# EAGLE schematic FUSE (EAGLE 9.2.2)
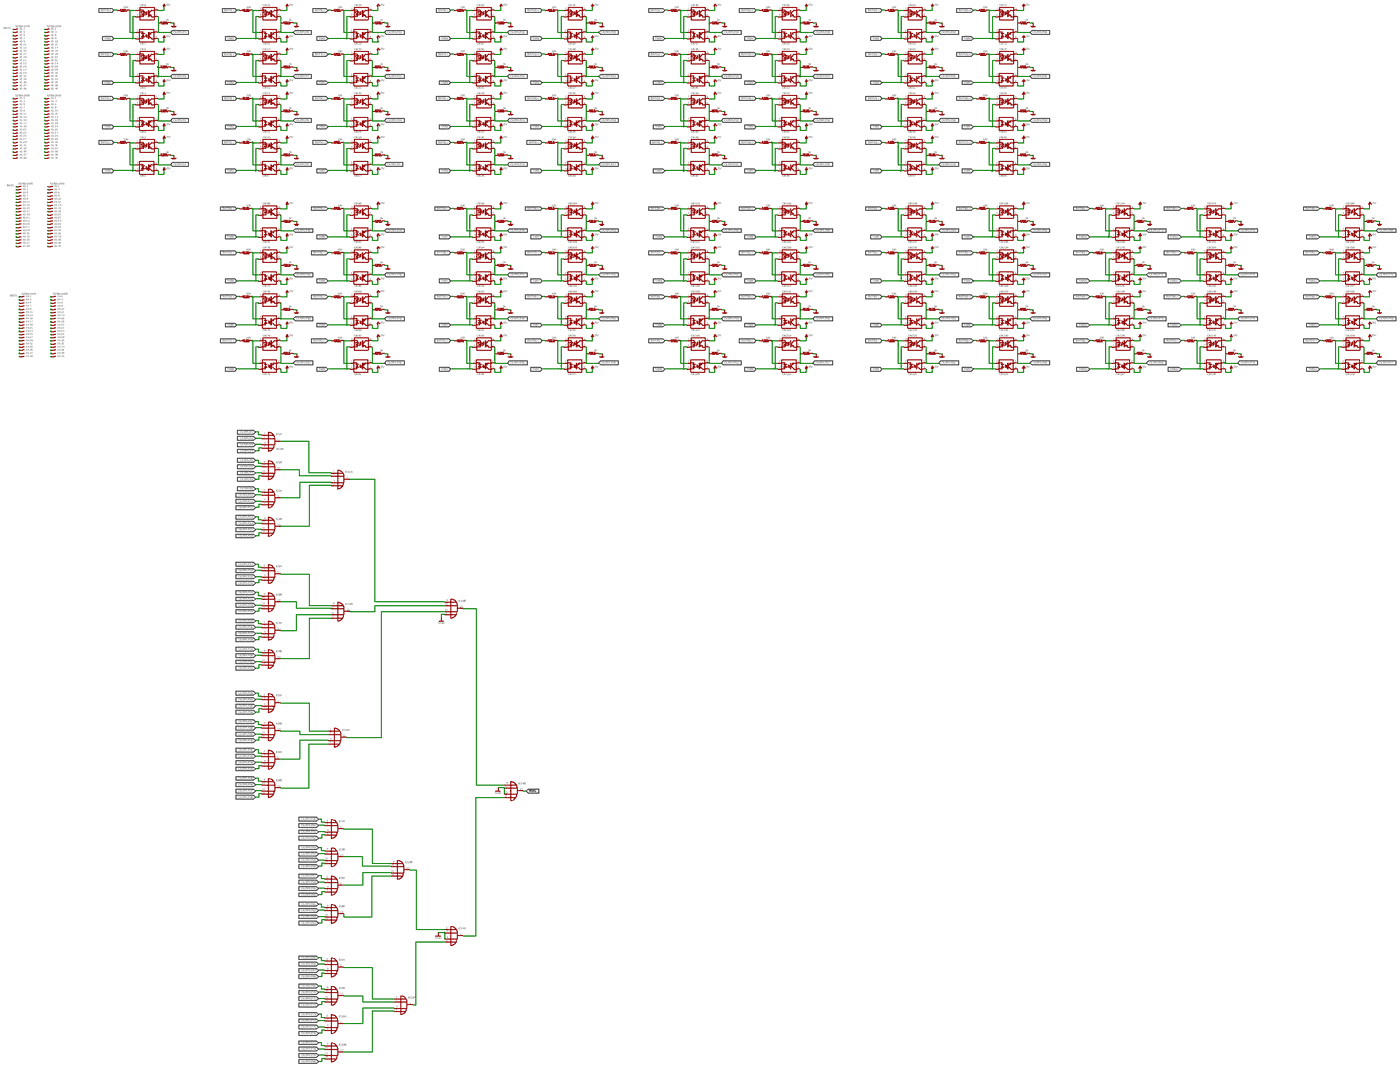
[diagram p0: schematic, sheet 1, overview]
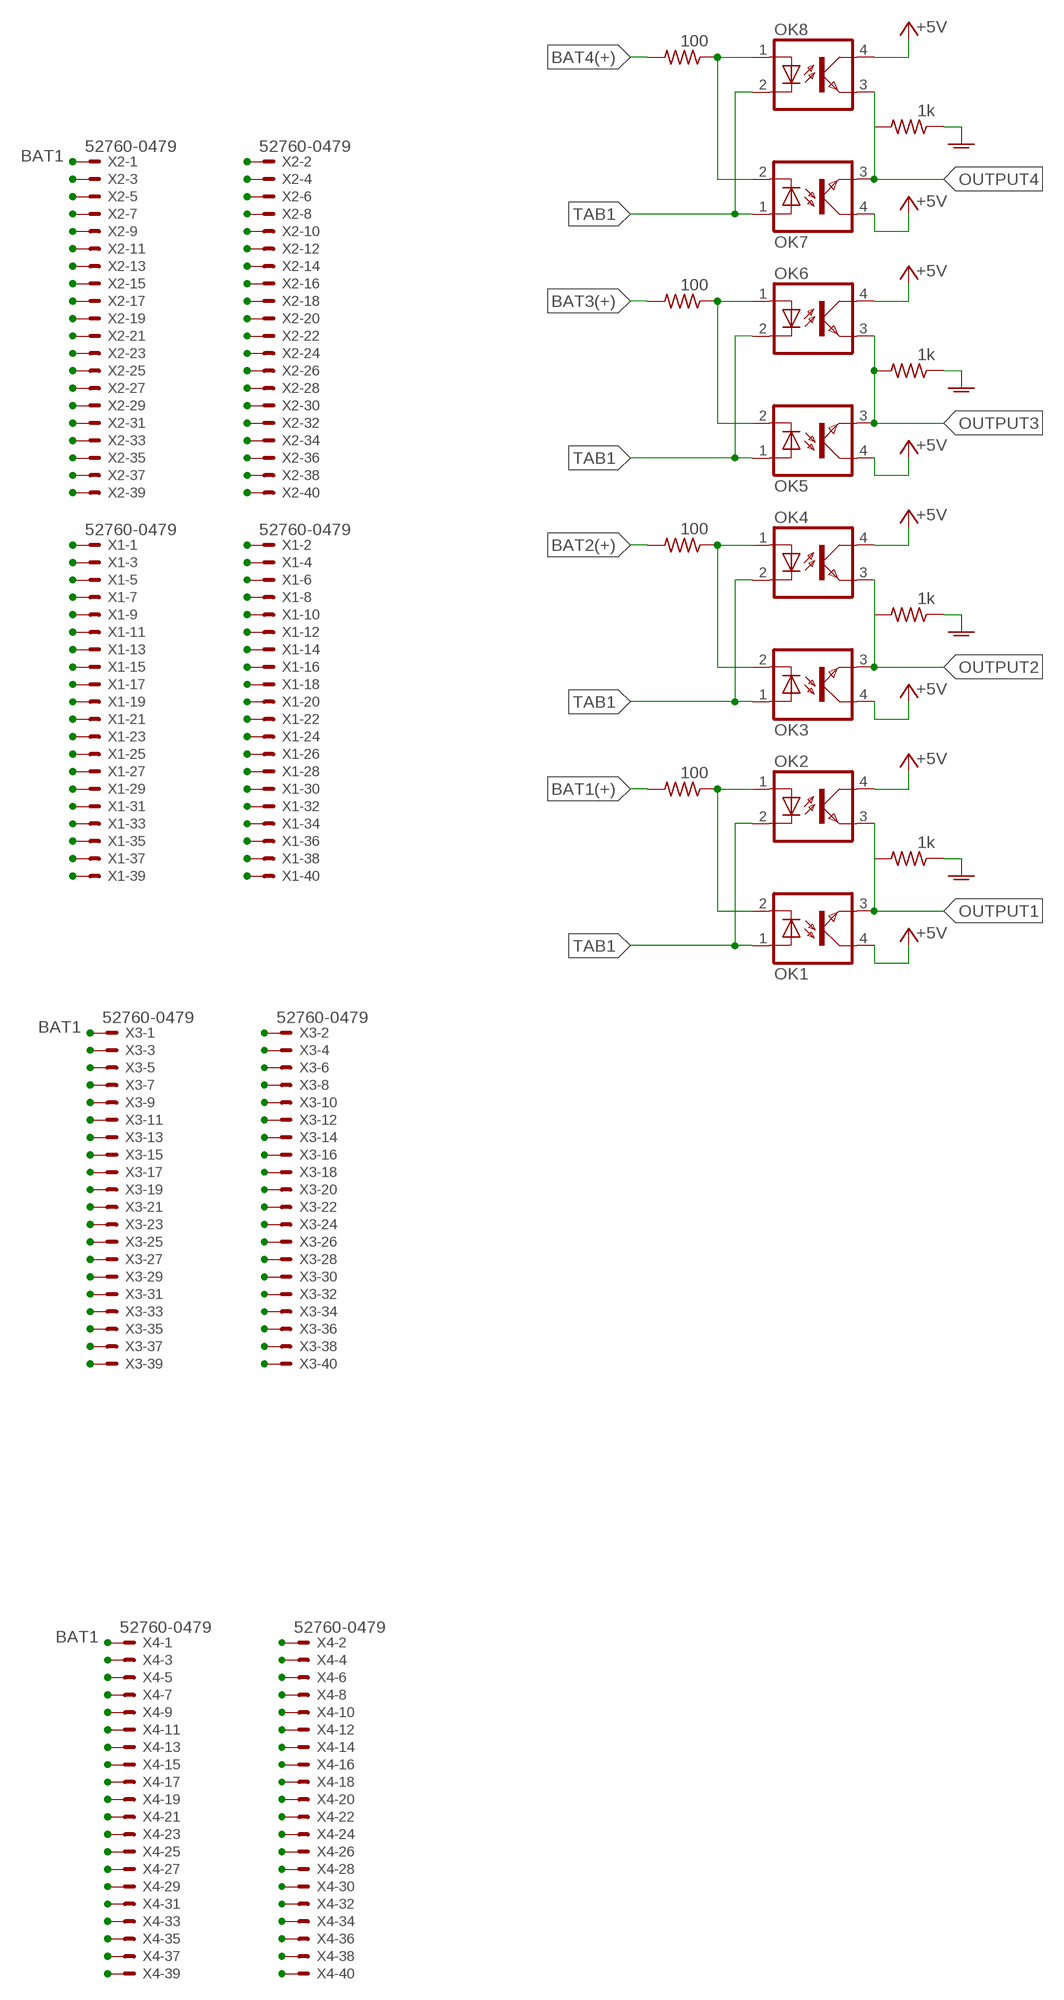
[diagram p1: schematic, sheet 1, part 1 of 5]
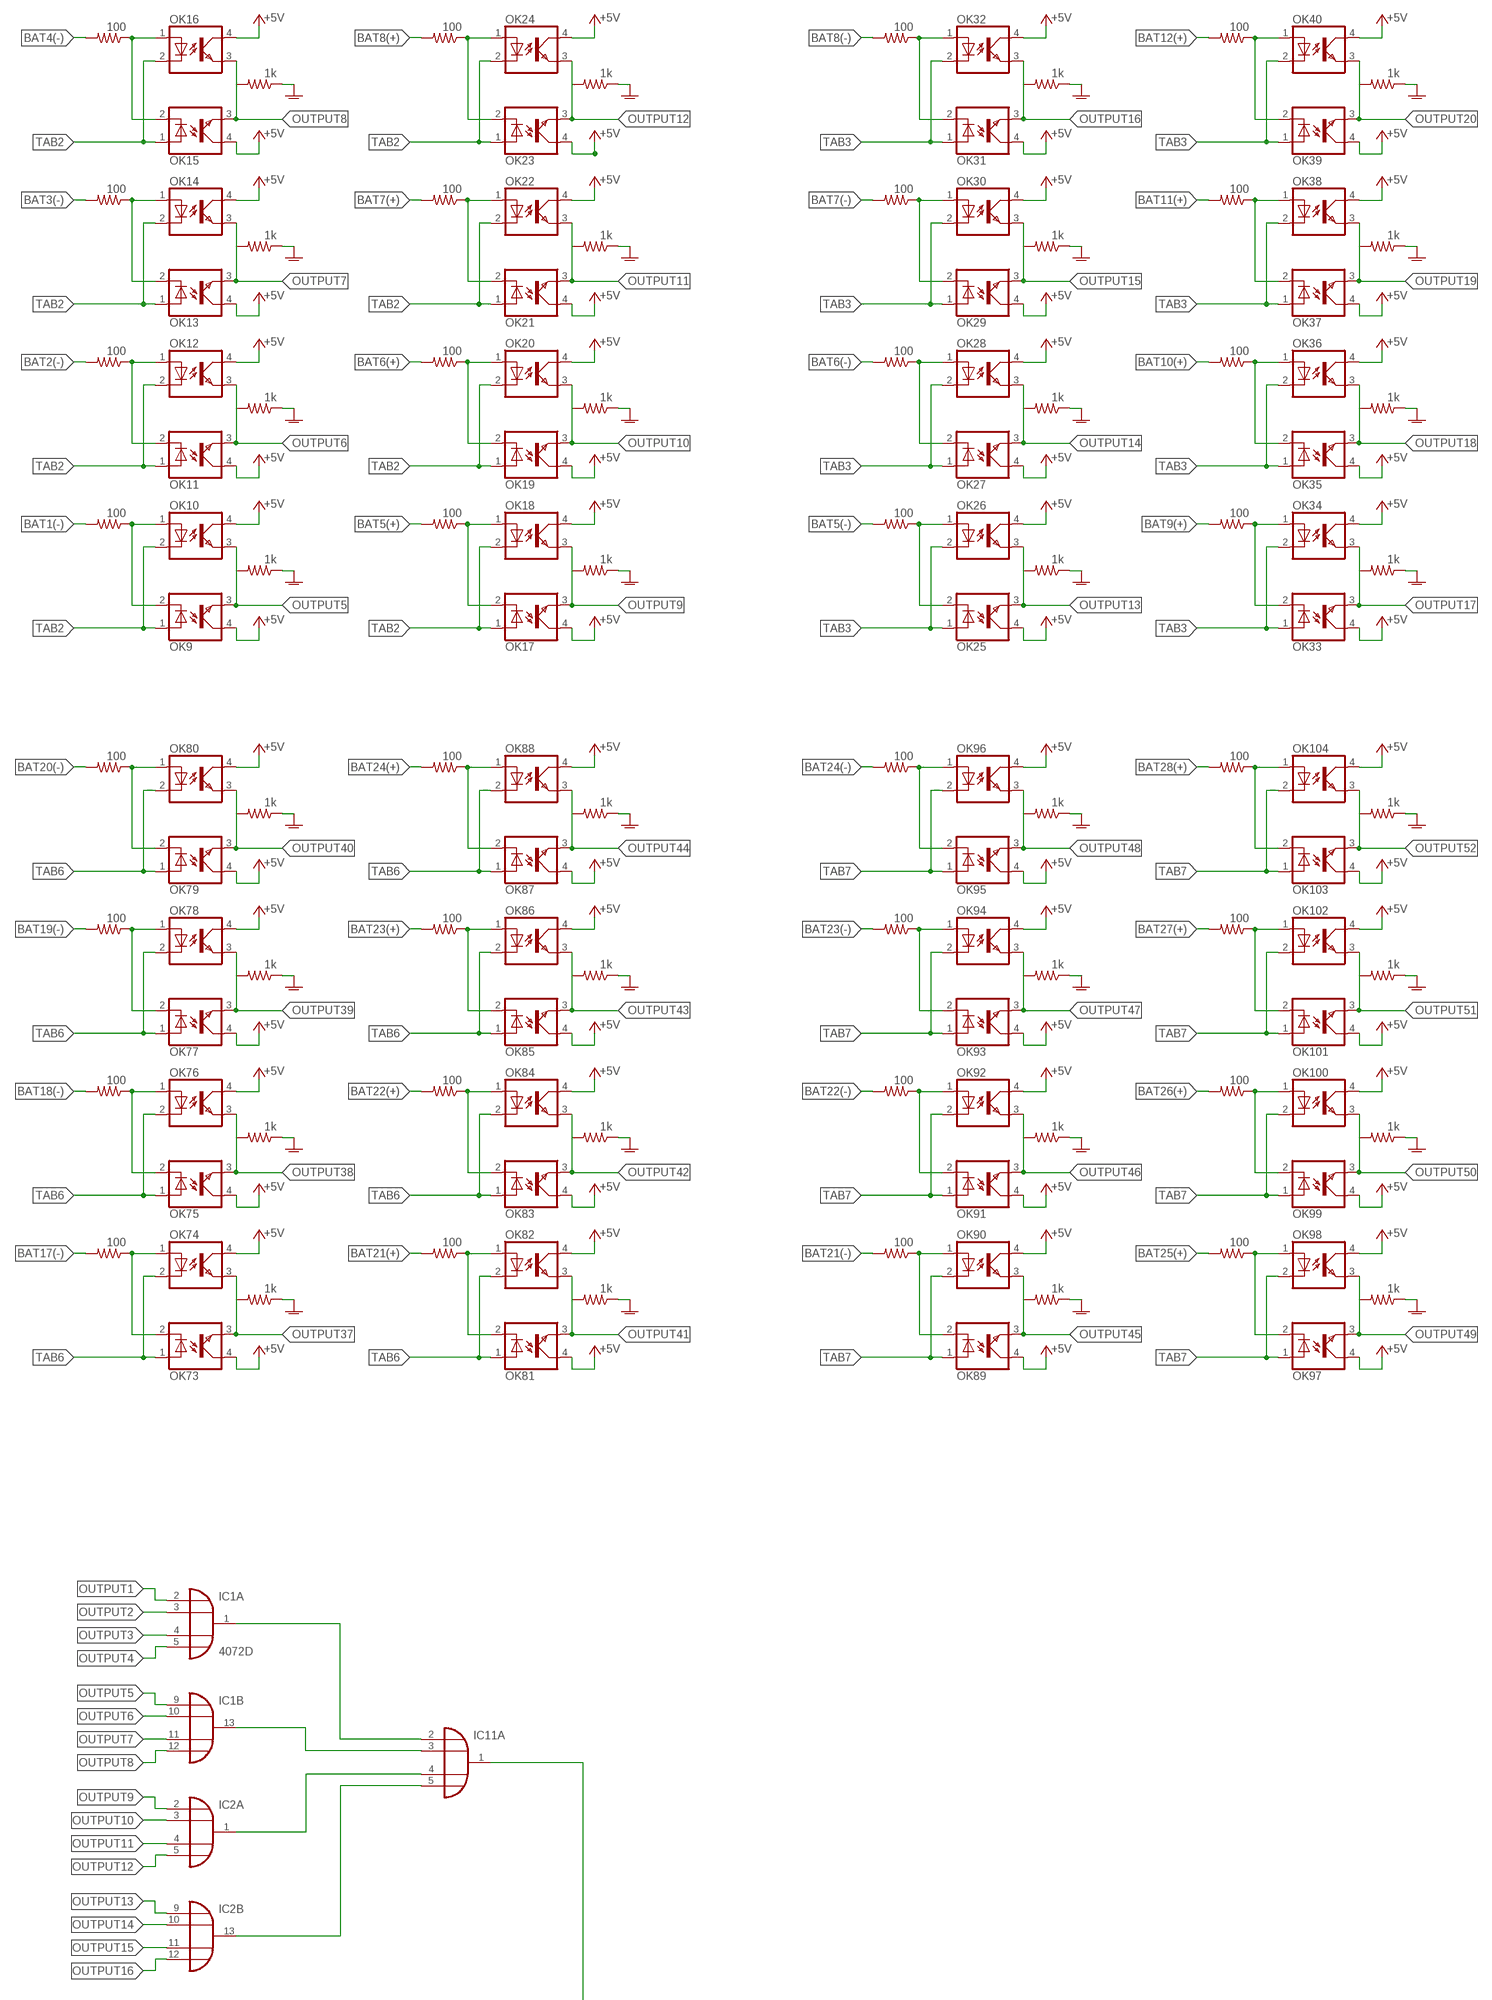
[diagram p2: schematic, sheet 1, part 2 of 5]
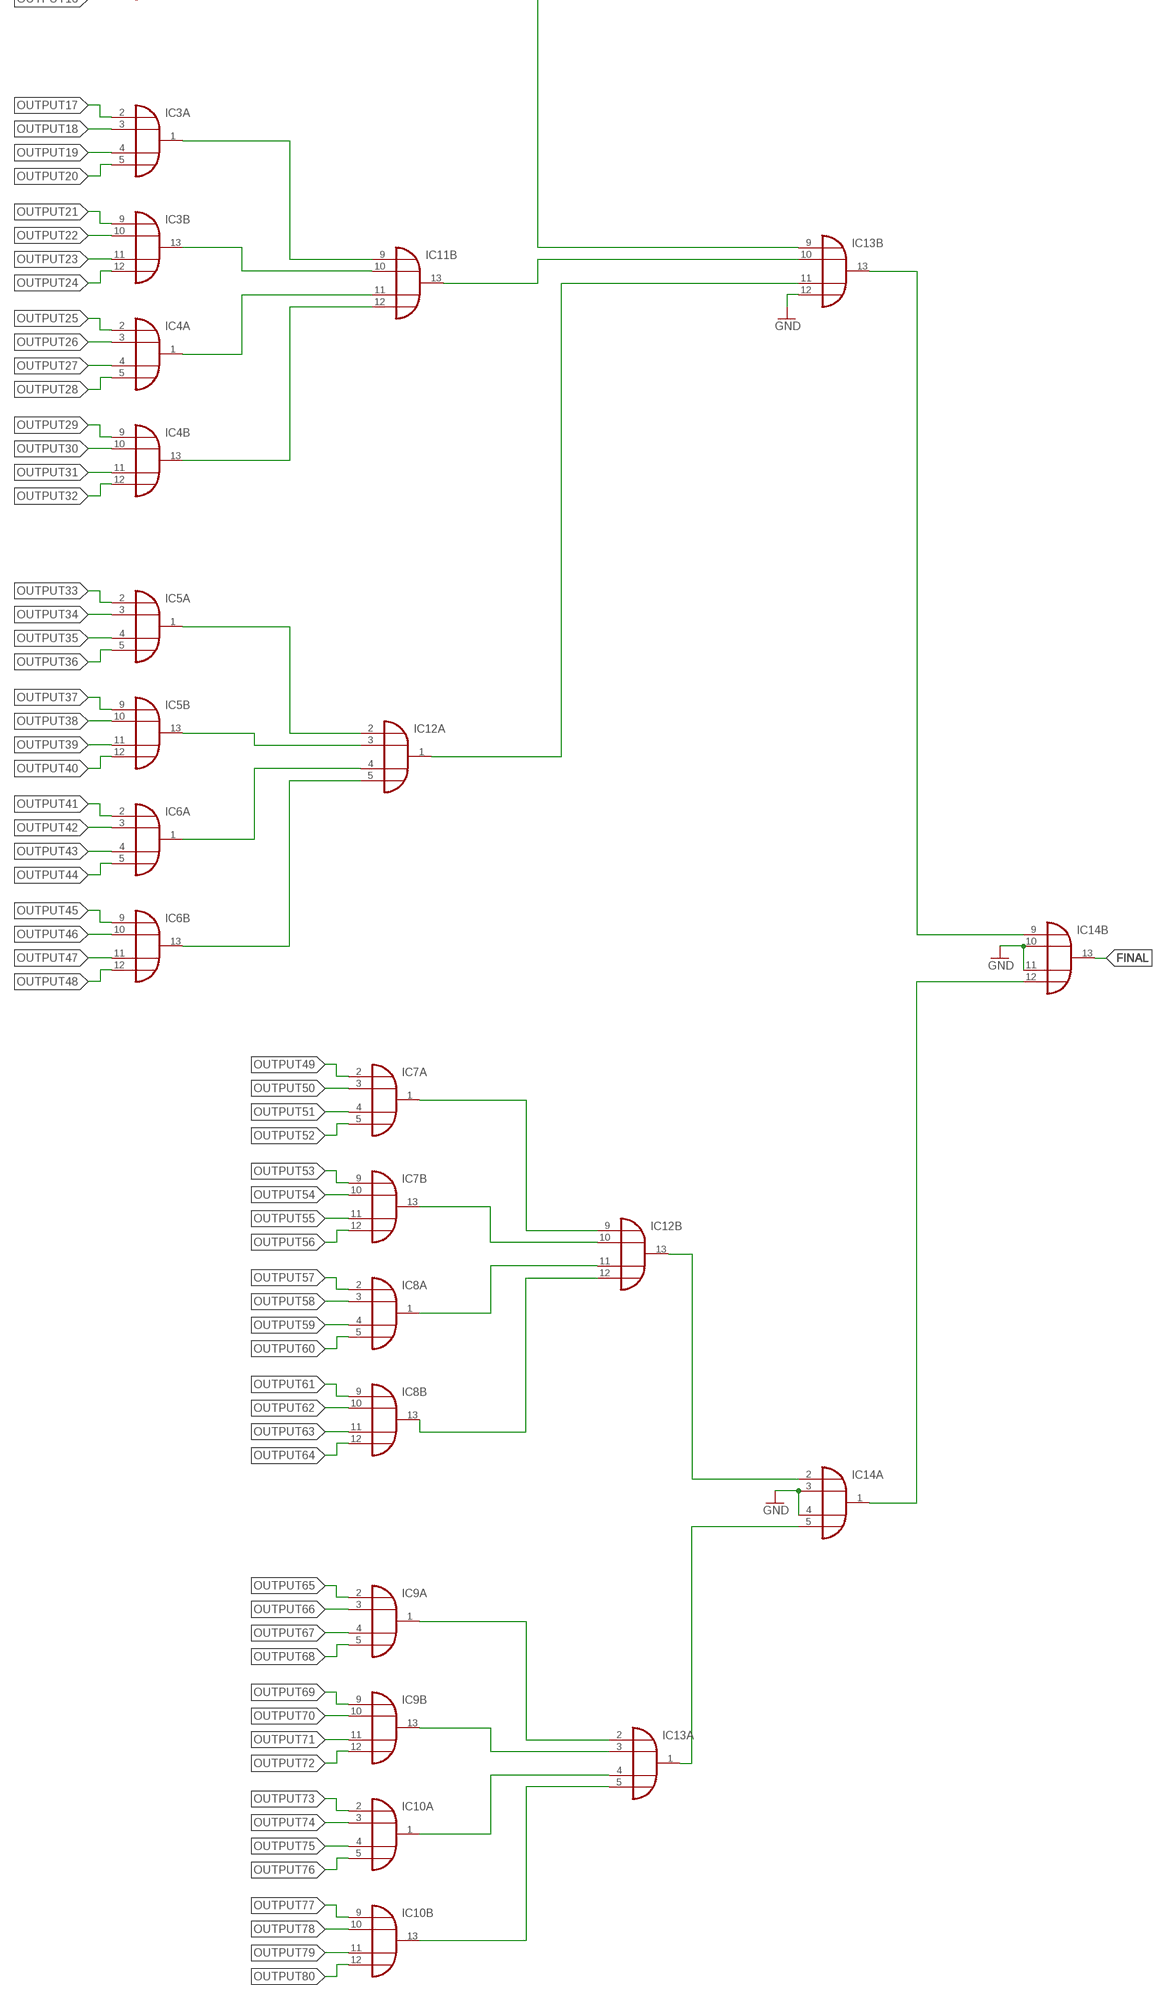
[diagram p3: schematic, sheet 1, part 3 of 5]
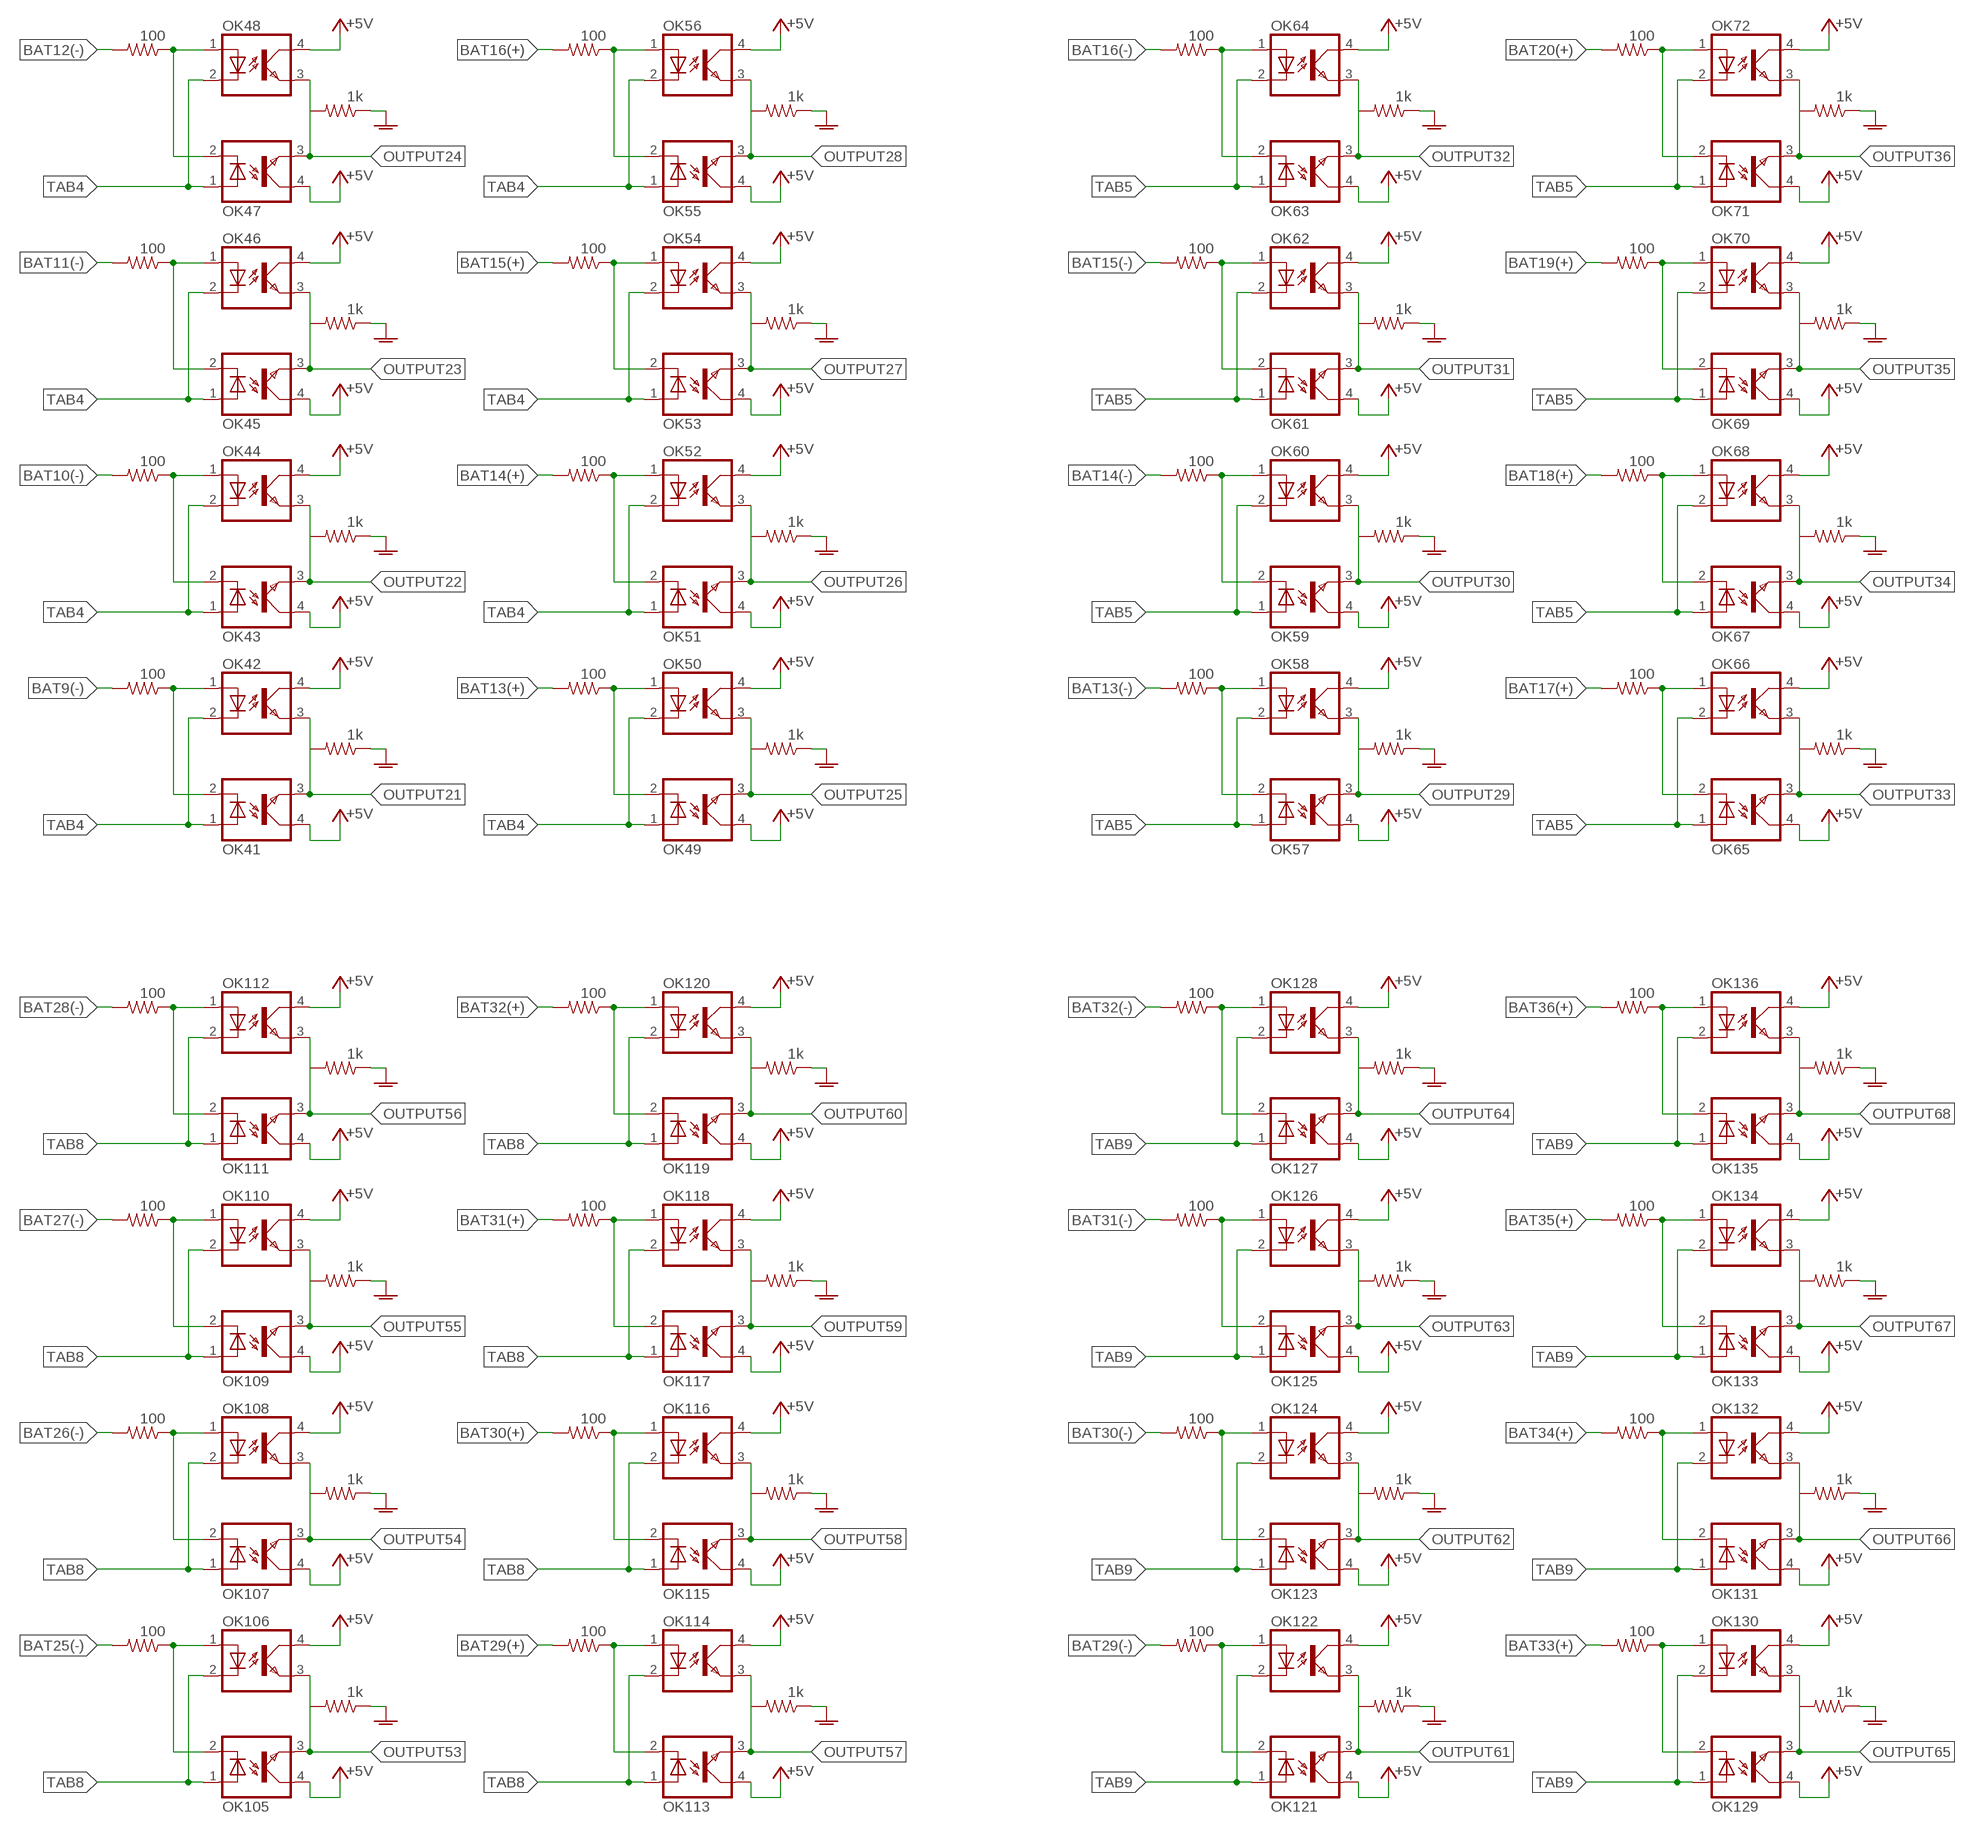
[diagram p4: schematic, sheet 1, part 4 of 5]
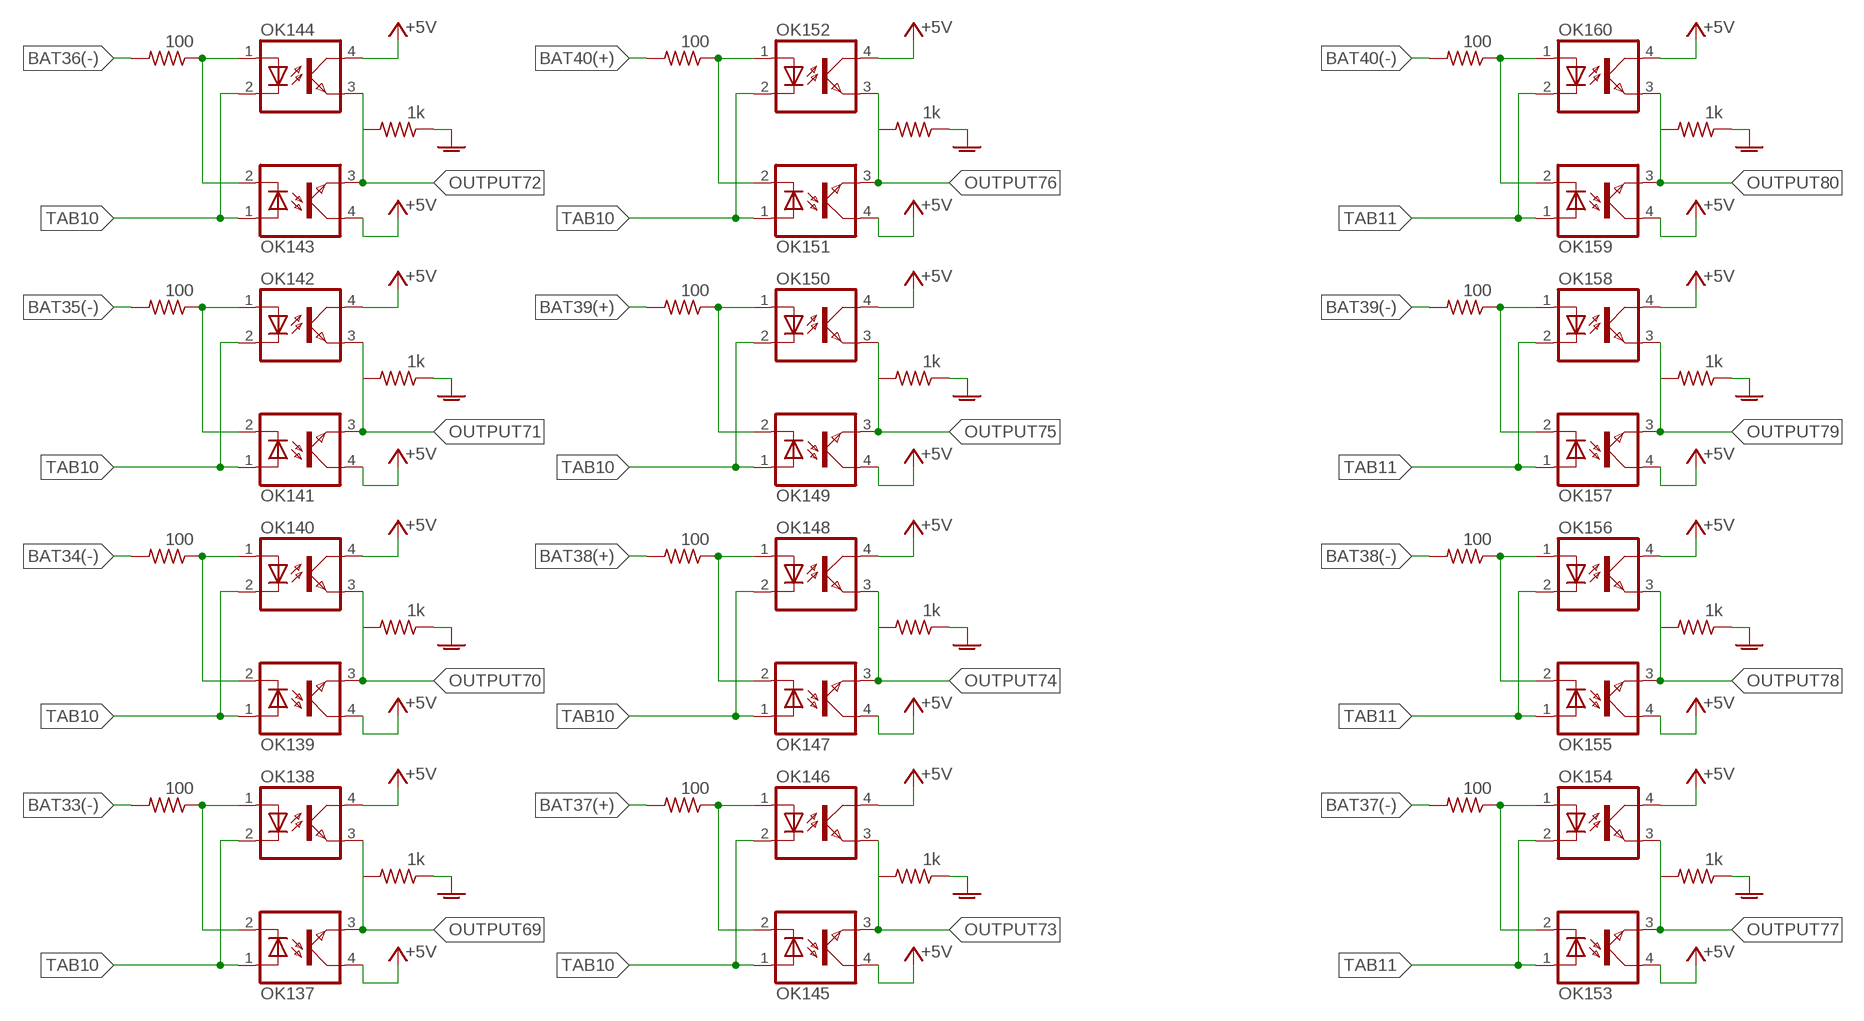
[diagram p5: schematic, sheet 1, part 5 of 5]

## Parts
IC1  4072D  [SO14]
IC2  4072D  [SO14]
IC3  4072D  [SO14]
IC4  4072D  [SO14]
IC5  4072D  [SO14]
IC6  4072D  [SO14]
IC7  4072D  [SO14]
IC8  4072D  [SO14]
IC9  4072D  [SO14]
IC10  4072D  [SO14]
IC11  4072D  [SO14]
IC12  4072D  [SO14]
IC13  4072D  [SO14]
IC14  4072D  [SO14]
OK1  PC817-S  [SOP04(2.54)]
OK2  PC817-S  [SOP04(2.54)]
OK3  PC817-S  [SOP04(2.54)]
OK4  PC817-S  [SOP04(2.54)]
OK5  PC817-S  [SOP04(2.54)]
OK6  PC817-S  [SOP04(2.54)]
OK7  PC817-S  [SOP04(2.54)]
OK8  PC817-S  [SOP04(2.54)]
OK9  PC817-S  [SOP04(2.54)]
OK10  PC817-S  [SOP04(2.54)]
OK11  PC817-S  [SOP04(2.54)]
OK12  PC817-S  [SOP04(2.54)]
OK13  PC817-S  [SOP04(2.54)]
OK14  PC817-S  [SOP04(2.54)]
OK15  PC817-S  [SOP04(2.54)]
OK16  PC817-S  [SOP04(2.54)]
OK17  PC817-S  [SOP04(2.54)]
OK18  PC817-S  [SOP04(2.54)]
OK19  PC817-S  [SOP04(2.54)]
OK20  PC817-S  [SOP04(2.54)]
OK21  PC817-S  [SOP04(2.54)]
OK22  PC817-S  [SOP04(2.54)]
OK23  PC817-S  [SOP04(2.54)]
OK24  PC817-S  [SOP04(2.54)]
OK25  PC817-S  [SOP04(2.54)]
OK26  PC817-S  [SOP04(2.54)]
OK27  PC817-S  [SOP04(2.54)]
OK28  PC817-S  [SOP04(2.54)]
OK29  PC817-S  [SOP04(2.54)]
OK30  PC817-S  [SOP04(2.54)]
OK31  PC817-S  [SOP04(2.54)]
OK32  PC817-S  [SOP04(2.54)]
OK33  PC817-S  [SOP04(2.54)]
OK34  PC817-S  [SOP04(2.54)]
OK35  PC817-S  [SOP04(2.54)]
OK36  PC817-S  [SOP04(2.54)]
OK37  PC817-S  [SOP04(2.54)]
OK38  PC817-S  [SOP04(2.54)]
OK39  PC817-S  [SOP04(2.54)]
OK40  PC817-S  [SOP04(2.54)]
OK41  PC817-S  [SOP04(2.54)]
OK42  PC817-S  [SOP04(2.54)]
OK43  PC817-S  [SOP04(2.54)]
OK44  PC817-S  [SOP04(2.54)]
OK45  PC817-S  [SOP04(2.54)]
OK46  PC817-S  [SOP04(2.54)]
OK47  PC817-S  [SOP04(2.54)]
OK48  PC817-S  [SOP04(2.54)]
OK49  PC817-S  [SOP04(2.54)]
OK50  PC817-S  [SOP04(2.54)]
OK51  PC817-S  [SOP04(2.54)]
OK52  PC817-S  [SOP04(2.54)]
OK53  PC817-S  [SOP04(2.54)]
OK54  PC817-S  [SOP04(2.54)]
OK55  PC817-S  [SOP04(2.54)]
OK56  PC817-S  [SOP04(2.54)]
OK57  PC817-S  [SOP04(2.54)]
OK58  PC817-S  [SOP04(2.54)]
OK59  PC817-S  [SOP04(2.54)]
OK60  PC817-S  [SOP04(2.54)]
OK61  PC817-S  [SOP04(2.54)]
OK62  PC817-S  [SOP04(2.54)]
OK63  PC817-S  [SOP04(2.54)]
OK64  PC817-S  [SOP04(2.54)]
OK65  PC817-S  [SOP04(2.54)]
OK66  PC817-S  [SOP04(2.54)]
OK67  PC817-S  [SOP04(2.54)]
OK68  PC817-S  [SOP04(2.54)]
OK69  PC817-S  [SOP04(2.54)]
OK70  PC817-S  [SOP04(2.54)]
OK71  PC817-S  [SOP04(2.54)]
OK72  PC817-S  [SOP04(2.54)]
OK73  PC817-S  [SOP04(2.54)]
OK74  PC817-S  [SOP04(2.54)]
OK75  PC817-S  [SOP04(2.54)]
OK76  PC817-S  [SOP04(2.54)]
OK77  PC817-S  [SOP04(2.54)]
OK78  PC817-S  [SOP04(2.54)]
OK79  PC817-S  [SOP04(2.54)]
OK80  PC817-S  [SOP04(2.54)]
OK81  PC817-S  [SOP04(2.54)]
OK82  PC817-S  [SOP04(2.54)]
OK83  PC817-S  [SOP04(2.54)]
OK84  PC817-S  [SOP04(2.54)]
OK85  PC817-S  [SOP04(2.54)]
OK86  PC817-S  [SOP04(2.54)]
OK87  PC817-S  [SOP04(2.54)]
OK88  PC817-S  [SOP04(2.54)]
OK89  PC817-S  [SOP04(2.54)]
OK90  PC817-S  [SOP04(2.54)]
OK91  PC817-S  [SOP04(2.54)]
OK92  PC817-S  [SOP04(2.54)]
OK93  PC817-S  [SOP04(2.54)]
OK94  PC817-S  [SOP04(2.54)]
OK95  PC817-S  [SOP04(2.54)]
OK96  PC817-S  [SOP04(2.54)]
OK97  PC817-S  [SOP04(2.54)]
OK98  PC817-S  [SOP04(2.54)]
OK99  PC817-S  [SOP04(2.54)]
OK100  PC817-S  [SOP04(2.54)]
OK101  PC817-S  [SOP04(2.54)]
OK102  PC817-S  [SOP04(2.54)]
OK103  PC817-S  [SOP04(2.54)]
OK104  PC817-S  [SOP04(2.54)]
OK105  PC817-S  [SOP04(2.54)]
OK106  PC817-S  [SOP04(2.54)]
OK107  PC817-S  [SOP04(2.54)]
OK108  PC817-S  [SOP04(2.54)]
OK109  PC817-S  [SOP04(2.54)]
OK110  PC817-S  [SOP04(2.54)]
OK111  PC817-S  [SOP04(2.54)]
OK112  PC817-S  [SOP04(2.54)]
OK113  PC817-S  [SOP04(2.54)]
OK114  PC817-S  [SOP04(2.54)]
OK115  PC817-S  [SOP04(2.54)]
OK116  PC817-S  [SOP04(2.54)]
OK117  PC817-S  [SOP04(2.54)]
OK118  PC817-S  [SOP04(2.54)]
OK119  PC817-S  [SOP04(2.54)]
OK120  PC817-S  [SOP04(2.54)]
OK121  PC817-S  [SOP04(2.54)]
OK122  PC817-S  [SOP04(2.54)]
OK123  PC817-S  [SOP04(2.54)]
OK124  PC817-S  [SOP04(2.54)]
OK125  PC817-S  [SOP04(2.54)]
OK126  PC817-S  [SOP04(2.54)]
OK127  PC817-S  [SOP04(2.54)]
OK128  PC817-S  [SOP04(2.54)]
OK129  PC817-S  [SOP04(2.54)]
OK130  PC817-S  [SOP04(2.54)]
OK131  PC817-S  [SOP04(2.54)]
OK132  PC817-S  [SOP04(2.54)]
OK133  PC817-S  [SOP04(2.54)]
OK134  PC817-S  [SOP04(2.54)]
OK135  PC817-S  [SOP04(2.54)]
OK136  PC817-S  [SOP04(2.54)]
OK137  PC817-S  [SOP04(2.54)]
OK138  PC817-S  [SOP04(2.54)]
OK139  PC817-S  [SOP04(2.54)]
OK140  PC817-S  [SOP04(2.54)]
OK141  PC817-S  [SOP04(2.54)]
OK142  PC817-S  [SOP04(2.54)]
OK143  PC817-S  [SOP04(2.54)]
OK144  PC817-S  [SOP04(2.54)]
OK145  PC817-S  [SOP04(2.54)]
OK146  PC817-S  [SOP04(2.54)]
OK147  PC817-S  [SOP04(2.54)]
OK148  PC817-S  [SOP04(2.54)]
OK149  PC817-S  [SOP04(2.54)]
OK150  PC817-S  [SOP04(2.54)]
OK151  PC817-S  [SOP04(2.54)]
OK152  PC817-S  [SOP04(2.54)]
OK153  PC817-S  [SOP04(2.54)]
OK154  PC817-S  [SOP04(2.54)]
OK155  PC817-S  [SOP04(2.54)]
OK156  PC817-S  [SOP04(2.54)]
OK157  PC817-S  [SOP04(2.54)]
OK158  PC817-S  [SOP04(2.54)]
OK159  PC817-S  [SOP04(2.54)]
OK160  PC817-S  [SOP04(2.54)]
R1  100  R-US_R0805  [R0805]
R2  100  R-US_R0805  [R0805]
R3  100  R-US_R0805  [R0805]
R4  100  R-US_R0805  [R0805]
R5  1k  R-US_R0805  [R0805]
R6  1k  R-US_R0805  [R0805]
R7  1k  R-US_R0805  [R0805]
R8  1k  R-US_R0805  [R0805]
R9  100  R-US_R0805  [R0805]
R10  100  R-US_R0805  [R0805]
R11  100  R-US_R0805  [R0805]
R12  100  R-US_R0805  [R0805]
R13  1k  R-US_R0805  [R0805]
R14  1k  R-US_R0805  [R0805]
R15  1k  R-US_R0805  [R0805]
R16  1k  R-US_R0805  [R0805]
R17  100  R-US_R0805  [R0805]
R18  100  R-US_R0805  [R0805]
R19  100  R-US_R0805  [R0805]
R20  100  R-US_R0805  [R0805]
R21  1k  R-US_R0805  [R0805]
R22  1k  R-US_R0805  [R0805]
R23  1k  R-US_R0805  [R0805]
R24  1k  R-US_R0805  [R0805]
R25  100  R-US_R0805  [R0805]
R26  100  R-US_R0805  [R0805]
R27  100  R-US_R0805  [R0805]
R28  100  R-US_R0805  [R0805]
R29  1k  R-US_R0805  [R0805]
R30  1k  R-US_R0805  [R0805]
R31  1k  R-US_R0805  [R0805]
R32  1k  R-US_R0805  [R0805]
R33  100  R-US_R0805  [R0805]
R34  100  R-US_R0805  [R0805]
R35  100  R-US_R0805  [R0805]
R36  100  R-US_R0805  [R0805]
R37  1k  R-US_R0805  [R0805]
R38  1k  R-US_R0805  [R0805]
R39  1k  R-US_R0805  [R0805]
R40  1k  R-US_R0805  [R0805]
R41  100  R-US_R0805  [R0805]
R42  100  R-US_R0805  [R0805]
R43  100  R-US_R0805  [R0805]
R44  100  R-US_R0805  [R0805]
R45  1k  R-US_R0805  [R0805]
R46  1k  R-US_R0805  [R0805]
R47  1k  R-US_R0805  [R0805]
R48  1k  R-US_R0805  [R0805]
R49  100  R-US_R0805  [R0805]
R50  100  R-US_R0805  [R0805]
R51  100  R-US_R0805  [R0805]
R52  100  R-US_R0805  [R0805]
R53  1k  R-US_R0805  [R0805]
R54  1k  R-US_R0805  [R0805]
R55  1k  R-US_R0805  [R0805]
R56  1k  R-US_R0805  [R0805]
R57  100  R-US_R0805  [R0805]
R58  100  R-US_R0805  [R0805]
R59  100  R-US_R0805  [R0805]
R60  100  R-US_R0805  [R0805]
R61  1k  R-US_R0805  [R0805]
R62  1k  R-US_R0805  [R0805]
R63  1k  R-US_R0805  [R0805]
R64  1k  R-US_R0805  [R0805]
R65  100  R-US_R0805  [R0805]
R66  100  R-US_R0805  [R0805]
R67  100  R-US_R0805  [R0805]
R68  100  R-US_R0805  [R0805]
R69  1k  R-US_R0805  [R0805]
R70  1k  R-US_R0805  [R0805]
R71  1k  R-US_R0805  [R0805]
R72  1k  R-US_R0805  [R0805]
R73  100  R-US_R0805  [R0805]
R74  100  R-US_R0805  [R0805]
R75  100  R-US_R0805  [R0805]
R76  100  R-US_R0805  [R0805]
R77  1k  R-US_R0805  [R0805]
R78  1k  R-US_R0805  [R0805]
R79  1k  R-US_R0805  [R0805]
R80  1k  R-US_R0805  [R0805]
R81  100  R-US_R0805  [R0805]
R82  100  R-US_R0805  [R0805]
R83  100  R-US_R0805  [R0805]
R84  100  R-US_R0805  [R0805]
R85  1k  R-US_R0805  [R0805]
R86  1k  R-US_R0805  [R0805]
R87  1k  R-US_R0805  [R0805]
R88  1k  R-US_R0805  [R0805]
R89  100  R-US_R0805  [R0805]
R90  100  R-US_R0805  [R0805]
R91  100  R-US_R0805  [R0805]
R92  100  R-US_R0805  [R0805]
R93  1k  R-US_R0805  [R0805]
R94  1k  R-US_R0805  [R0805]
R95  1k  R-US_R0805  [R0805]
R96  1k  R-US_R0805  [R0805]
R97  100  R-US_R0805  [R0805]
R98  100  R-US_R0805  [R0805]
R99  100  R-US_R0805  [R0805]
R100  100  R-US_R0805  [R0805]
R101  1k  R-US_R0805  [R0805]
R102  1k  R-US_R0805  [R0805]
R103  1k  R-US_R0805  [R0805]
R104  1k  R-US_R0805  [R0805]
R105  100  R-US_R0805  [R0805]
R106  100  R-US_R0805  [R0805]
R107  100  R-US_R0805  [R0805]
R108  100  R-US_R0805  [R0805]
R109  1k  R-US_R0805  [R0805]
R110  1k  R-US_R0805  [R0805]
R111  1k  R-US_R0805  [R0805]
R112  1k  R-US_R0805  [R0805]
R113  100  R-US_R0805  [R0805]
R114  100  R-US_R0805  [R0805]
R115  100  R-US_R0805  [R0805]
R116  100  R-US_R0805  [R0805]
R117  1k  R-US_R0805  [R0805]
R118  1k  R-US_R0805  [R0805]
R119  1k  R-US_R0805  [R0805]
R120  1k  R-US_R0805  [R0805]
R121  100  R-US_R0805  [R0805]
R122  100  R-US_R0805  [R0805]
R123  100  R-US_R0805  [R0805]
R124  100  R-US_R0805  [R0805]
R125  1k  R-US_R0805  [R0805]
R126  1k  R-US_R0805  [R0805]
R127  1k  R-US_R0805  [R0805]
R128  1k  R-US_R0805  [R0805]
R129  100  R-US_R0805  [R0805]
R130  100  R-US_R0805  [R0805]
R131  100  R-US_R0805  [R0805]
R132  100  R-US_R0805  [R0805]
R133  1k  R-US_R0805  [R0805]
R134  1k  R-US_R0805  [R0805]
R135  1k  R-US_R0805  [R0805]
R136  1k  R-US_R0805  [R0805]
R137  100  R-US_R0805  [R0805]
R138  100  R-US_R0805  [R0805]
R139  100  R-US_R0805  [R0805]
R140  100  R-US_R0805  [R0805]
R141  1k  R-US_R0805  [R0805]
R142  1k  R-US_R0805  [R0805]
R143  1k  R-US_R0805  [R0805]
R144  1k  R-US_R0805  [R0805]
R145  100  R-US_R0805  [R0805]
R146  100  R-US_R0805  [R0805]
R147  100  R-US_R0805  [R0805]
R148  100  R-US_R0805  [R0805]
R149  1k  R-US_R0805  [R0805]
R150  1k  R-US_R0805  [R0805]
R151  1k  R-US_R0805  [R0805]
R152  1k  R-US_R0805  [R0805]
R153  100  R-US_R0805  [R0805]
R154  100  R-US_R0805  [R0805]
R155  100  R-US_R0805  [R0805]
R156  100  R-US_R0805  [R0805]
R157  1k  R-US_R0805  [R0805]
R158  1k  R-US_R0805  [R0805]
R159  1k  R-US_R0805  [R0805]
R160  1k  R-US_R0805  [R0805]
X1  52760-0479  [52760-0479]
X2  52760-0479  [52760-0479]
X3  52760-0479  [52760-0479]
X4  52760-0479  [52760-0479]

## Nets
+5V: OK1.4(COL) OK2.4(COL) OK3.4(COL) OK4.4(COL) OK5.4(COL) OK6.4(COL) OK7.4(COL) OK8.4(COL) OK9.4(COL) OK10.4(COL) OK11.4(COL) OK12.4(COL) OK13.4(COL) OK14.4(COL) OK15.4(COL) OK16.4(COL) OK17.4(COL) OK18.4(COL) OK19.4(COL) OK20.4(COL) OK21.4(COL) OK22.4(COL) OK23.4(COL) OK24.4(COL) OK25.4(COL) OK26.4(COL) OK27.4(COL) OK28.4(COL) OK29.4(COL) OK30.4(COL) OK31.4(COL) OK32.4(COL) OK33.4(COL) OK34.4(COL) OK35.4(COL) OK36.4(COL) OK37.4(COL) OK38.4(COL) OK39.4(COL) OK40.4(COL) OK41.4(COL) OK42.4(COL) OK43.4(COL) OK44.4(COL) OK45.4(COL) OK46.4(COL) OK47.4(COL) OK48.4(COL) OK49.4(COL) OK50.4(COL) OK51.4(COL) OK52.4(COL) OK53.4(COL) OK54.4(COL) OK55.4(COL) OK56.4(COL) OK57.4(COL) OK58.4(COL) OK59.4(COL) OK60.4(COL) OK61.4(COL) OK62.4(COL) OK63.4(COL) OK64.4(COL) OK65.4(COL) OK66.4(COL) OK67.4(COL) OK68.4(COL) OK69.4(COL) OK70.4(COL) OK71.4(COL) OK72.4(COL) OK73.4(COL) OK74.4(COL) OK75.4(COL) OK76.4(COL) OK77.4(COL) OK78.4(COL) OK79.4(COL) OK80.4(COL) OK81.4(COL) OK82.4(COL) OK83.4(COL) OK84.4(COL) OK85.4(COL) OK86.4(COL) OK87.4(COL) OK88.4(COL) OK89.4(COL) OK90.4(COL) OK91.4(COL) OK92.4(COL) OK93.4(COL) OK94.4(COL) OK95.4(COL) OK96.4(COL) OK97.4(COL) OK98.4(COL) OK99.4(COL) OK100.4(COL) OK101.4(COL) OK102.4(COL) OK103.4(COL) OK104.4(COL) OK105.4(COL) OK106.4(COL) OK107.4(COL) OK108.4(COL) OK109.4(COL) OK110.4(COL) OK111.4(COL) OK112.4(COL) OK113.4(COL) OK114.4(COL) OK115.4(COL) OK116.4(COL) OK117.4(COL) OK118.4(COL) OK119.4(COL) OK120.4(COL) OK121.4(COL) OK122.4(COL) OK123.4(COL) OK124.4(COL) OK125.4(COL) OK126.4(COL) OK127.4(COL) OK128.4(COL) OK129.4(COL) OK130.4(COL) OK131.4(COL) OK132.4(COL) OK133.4(COL) OK134.4(COL) OK135.4(COL) OK136.4(COL) OK137.4(COL) OK138.4(COL) OK139.4(COL) OK140.4(COL) OK141.4(COL) OK142.4(COL) OK143.4(COL) OK144.4(COL) OK145.4(COL) OK146.4(COL) OK147.4(COL) OK148.4(COL) OK149.4(COL) OK150.4(COL) OK151.4(COL) OK152.4(COL) OK153.4(COL) OK154.4(COL) OK155.4(COL) OK156.4(COL) OK157.4(COL) OK158.4(COL) OK159.4(COL) OK160.4(COL)
AGND: R5.1 R6.1 R7.1 R8.1 R13.1 R14.1 R15.1 R16.1 R21.1 R22.1 R23.1 R24.1 R29.1 R30.1 R31.1 R32.1 R37.1 R38.1 R39.1 R40.1 R45.1 R46.1 R47.1 R48.1 R53.1 R54.1 R55.1 R56.1 R61.1 R62.1 R63.1 R64.1 R69.1 R70.1 R71.1 R72.1 R77.1 R78.1 R79.1 R80.1 R85.1 R86.1 R87.1 R88.1 R93.1 R94.1 R95.1 R96.1 R101.1 R102.1 R103.1 R104.1 R109.1 R110.1 R111.1 R112.1 R117.1 R118.1 R119.1 R120.1 R125.1 R126.1 R127.1 R128.1 R133.1 R134.1 R135.1 R136.1 R141.1 R142.1 R143.1 R144.1 R149.1 R150.1 R151.1 R152.1 R157.1 R158.1 R159.1 R160.1
BAT1: X2.1 X3.1 X4.1
BAT1(+): R1.2
BAT1(-): R9.2
BAT2(+): R2.2
BAT2(-): R10.2
BAT3(+): R3.2
BAT3(-): R11.2
BAT4(+): R4.2
BAT4(-): R12.2
BAT5(+): R17.2
BAT5(-): R25.2
BAT6(+): R18.2
BAT6(-): R26.2
BAT7(+): R19.2
BAT7(-): R27.2
BAT8(+): R20.2
BAT8(-): R28.2
BAT9(+): R33.2
BAT9(-): R41.2
BAT10(+): R34.2
BAT10(-): R42.2
BAT11(+): R35.2
BAT11(-): R43.2
BAT12(+): R36.2
BAT12(-): R44.2
BAT13(+): R49.2
BAT13(-): R57.2
BAT14(+): R50.2
BAT14(-): R58.2
BAT15(+): R51.2
BAT15(-): R59.2
BAT16(+): R52.2
BAT16(-): R60.2
BAT17(+): R65.2
BAT17(-): R73.2
BAT18(+): R66.2
BAT18(-): R74.2
BAT19(+): R67.2
BAT19(-): R75.2
BAT20(+): R68.2
BAT20(-): R76.2
BAT21(+): R81.2
BAT21(-): R89.2
BAT22(+): R82.2
BAT22(-): R90.2
BAT23(+): R83.2
BAT23(-): R91.2
BAT24(+): R84.2
BAT24(-): R92.2
BAT25(+): R97.2
BAT25(-): R105.2
BAT26(+): R98.2
BAT26(-): R106.2
BAT27(+): R99.2
BAT27(-): R107.2
BAT28(+): R100.2
BAT28(-): R108.2
BAT29(+): R113.2
BAT29(-): R121.2
BAT30(+): R114.2
BAT30(-): R122.2
BAT31(+): R115.2
BAT31(-): R123.2
BAT32(+): R116.2
BAT32(-): R124.2
BAT33(+): R129.2
BAT33(-): R137.2
BAT34(+): R130.2
BAT34(-): R138.2
BAT35(+): R131.2
BAT35(-): R139.2
BAT36(+): R132.2
BAT36(-): R140.2
BAT37(+): R145.2
BAT37(-): R153.2
BAT38(+): R146.2
BAT38(-): R154.2
BAT39(+): R147.2
BAT39(-): R155.2
BAT40(+): R148.2
BAT40(-): R156.2
FINAL: IC14.13(B:O)
GND: IC13.12(B:I3) IC14.3(A:I1) IC14.4(A:I2) IC14.10(B:I1) IC14.11(B:I2)
N$1: OK1.2(C) OK2.1(A) R1.1
N$2: IC1.1(A:O) IC11.2(A:I0)
N$3: OK3.2(C) OK4.1(A) R2.1
N$4: OK25.2(C) OK26.1(A) R25.1
N$5: IC1.13(B:O) IC11.3(A:I1)
N$6: OK5.2(C) OK6.1(A) R3.1
N$7: IC2.1(A:O) IC11.4(A:I2)
N$8: OK7.2(C) OK8.1(A) R4.1
N$9: IC2.13(B:O) IC11.5(A:I3)
N$10: IC3.1(A:O) IC11.9(B:I0)
N$11: OK27.2(C) OK28.1(A) R26.1
N$12: IC3.13(B:O) IC11.10(B:I1)
N$13: OK29.2(C) OK30.1(A) R27.1
N$14: IC4.1(A:O) IC11.11(B:I2)
N$15: OK31.2(C) OK32.1(A) R28.1
N$16: IC4.13(B:O) IC11.12(B:I3)
N$17: OK33.2(C) OK34.1(A) R33.1
N$18: IC5.1(A:O) IC12.2(A:I0)
N$19: OK35.2(C) OK36.1(A) R34.1
N$20: IC5.13(B:O) IC12.3(A:I1)
N$21: OK37.2(C) OK38.1(A) R35.1
N$22: IC6.1(A:O) IC12.4(A:I2)
N$23: OK39.2(C) OK40.1(A) R36.1
N$24: IC6.13(B:O) IC12.5(A:I3)
N$25: OK41.2(C) OK42.1(A) R41.1
N$26: IC7.1(A:O) IC12.9(B:I0)
N$27: OK43.2(C) OK44.1(A) R42.1
N$28: IC7.13(B:O) IC12.10(B:I1)
N$29: OK45.2(C) OK46.1(A) R43.1
N$30: IC8.1(A:O) IC12.11(B:I2)
N$31: OK47.2(C) OK48.1(A) R44.1
N$32: IC8.13(B:O) IC12.12(B:I3)
N$33: OK49.2(C) OK50.1(A) R49.1
N$34: IC9.1(A:O) IC13.2(A:I0)
N$35: OK51.2(C) OK52.1(A) R50.1
N$36: IC9.13(B:O) IC13.3(A:I1)
N$37: OK53.2(C) OK54.1(A) R51.1
N$38: IC10.1(A:O) IC13.4(A:I2)
N$39: OK55.2(C) OK56.1(A) R52.1
N$40: IC10.13(B:O) IC13.5(A:I3)
N$41: OK9.2(C) OK10.1(A) R9.1
N$42: IC11.1(A:O) IC13.9(B:I0)
N$43: OK11.2(C) OK12.1(A) R10.1
N$44: IC11.13(B:O) IC13.10(B:I1)
N$45: OK13.2(C) OK14.1(A) R11.1
N$46: IC12.1(A:O) IC13.11(B:I2)
N$47: OK15.2(C) OK16.1(A) R12.1
N$48: IC13.13(B:O) IC14.9(B:I0)
N$49: OK17.2(C) OK18.1(A) R17.1
N$50: IC12.13(B:O) IC14.2(A:I0)
N$51: OK19.2(C) OK20.1(A) R18.1
N$52: IC13.1(A:O) IC14.5(A:I3)
N$53: OK21.2(C) OK22.1(A) R19.1
N$54: IC14.1(A:O) IC14.12(B:I3)
N$55: OK23.2(C) OK24.1(A) R20.1
N$57: OK57.2(C) OK58.1(A) R57.1
N$59: OK59.2(C) OK60.1(A) R58.1
N$61: OK61.2(C) OK62.1(A) R59.1
N$63: OK63.2(C) OK64.1(A) R60.1
N$65: OK65.2(C) OK66.1(A) R65.1
N$67: OK67.2(C) OK68.1(A) R66.1
N$69: OK69.2(C) OK70.1(A) R67.1
N$71: OK71.2(C) OK72.1(A) R68.1
N$73: OK73.2(C) OK74.1(A) R73.1
N$75: OK75.2(C) OK76.1(A) R74.1
N$77: OK77.2(C) OK78.1(A) R75.1
N$79: OK79.2(C) OK80.1(A) R76.1
N$81: OK81.2(C) OK82.1(A) R81.1
N$83: OK83.2(C) OK84.1(A) R82.1
N$85: OK85.2(C) OK86.1(A) R83.1
N$87: OK87.2(C) OK88.1(A) R84.1
N$89: OK89.2(C) OK90.1(A) R89.1
N$91: OK91.2(C) OK92.1(A) R90.1
N$93: OK93.2(C) OK94.1(A) R91.1
N$95: OK95.2(C) OK96.1(A) R92.1
N$97: OK97.2(C) OK98.1(A) R97.1
N$99: OK99.2(C) OK100.1(A) R98.1
N$101: OK101.2(C) OK102.1(A) R99.1
N$103: OK103.2(C) OK104.1(A) R100.1
N$105: OK105.2(C) OK106.1(A) R105.1
N$107: OK107.2(C) OK108.1(A) R106.1
N$109: OK109.2(C) OK110.1(A) R107.1
N$111: OK111.2(C) OK112.1(A) R108.1
N$113: OK113.2(C) OK114.1(A) R113.1
N$115: OK115.2(C) OK116.1(A) R114.1
N$117: OK117.2(C) OK118.1(A) R115.1
N$119: OK119.2(C) OK120.1(A) R116.1
N$121: OK121.2(C) OK122.1(A) R121.1
N$123: OK123.2(C) OK124.1(A) R122.1
N$125: OK125.2(C) OK126.1(A) R123.1
N$127: OK127.2(C) OK128.1(A) R124.1
N$129: OK129.2(C) OK130.1(A) R129.1
N$131: OK131.2(C) OK132.1(A) R130.1
N$133: OK133.2(C) OK134.1(A) R131.1
N$135: OK135.2(C) OK136.1(A) R132.1
N$137: OK137.2(C) OK138.1(A) R137.1
N$139: OK139.2(C) OK140.1(A) R138.1
N$141: OK141.2(C) OK142.1(A) R139.1
N$143: OK143.2(C) OK144.1(A) R140.1
N$145: OK145.2(C) OK146.1(A) R145.1
N$147: OK147.2(C) OK148.1(A) R146.1
N$149: OK149.2(C) OK150.1(A) R147.1
N$151: OK151.2(C) OK152.1(A) R148.1
N$153: OK153.2(C) OK154.1(A) R153.1
N$155: OK155.2(C) OK156.1(A) R154.1
N$157: OK157.2(C) OK158.1(A) R155.1
N$159: OK159.2(C) OK160.1(A) R156.1
N$161: X2.3
N$162: X2.5
N$163: X2.7
N$164: X2.9
N$165: X2.11
N$166: X2.13
N$167: X2.15
N$168: X2.17
N$169: X2.19
N$170: X2.21
N$171: X2.23
N$172: X2.25
N$173: X2.27
N$174: X2.29
N$175: X2.31
N$176: X2.33
N$177: X2.35
N$178: X2.37
N$179: X2.39
N$180: X1.1
N$181: X1.3
N$182: X1.5
N$183: X1.7
N$184: X1.9
N$185: X1.11
N$186: X1.13
N$187: X1.15
N$188: X1.17
N$189: X1.19
N$190: X1.21
N$191: X1.23
N$192: X1.25
N$193: X1.27
N$194: X1.29
N$195: X1.31
N$196: X1.33
N$197: X1.35
N$198: X1.37
N$199: X1.39
N$200: X1.40
N$201: X1.38
N$202: X1.36
N$203: X1.34
N$204: X1.32
N$205: X1.30
N$206: X1.28
N$207: X1.26
N$208: X1.24
N$209: X1.22
N$210: X1.20
N$211: X1.18
N$212: X1.16
N$213: X1.14
N$214: X1.12
N$215: X1.10
N$216: X1.8
N$217: X1.6
N$218: X1.4
N$219: X1.2
N$220: X2.40
N$221: X2.38
N$222: X2.36
N$223: X2.34
N$224: X2.32
N$225: X2.30
N$226: X2.28
N$227: X2.26
N$228: X2.24
N$229: X2.22
N$230: X2.20
N$231: X2.18
N$232: X2.16
N$233: X2.14
N$234: X2.12
N$235: X2.10
N$236: X2.8
N$237: X2.6
N$238: X2.4
N$239: X2.2
N$240: X3.3
N$241: X3.5
N$242: X3.7
N$243: X3.9
N$244: X3.11
N$245: X3.13
N$246: X3.15
N$247: X3.17
N$248: X3.19
N$249: X3.21
N$250: X3.23
N$251: X3.25
N$252: X3.27
N$253: X3.29
N$254: X3.31
N$255: X3.33
N$256: X3.35
N$257: X3.37
N$258: X3.39
N$259: X3.40
N$260: X3.38
N$261: X3.36
N$262: X3.34
N$263: X3.32
N$264: X3.30
N$265: X3.28
N$266: X3.26
N$267: X3.24
N$268: X3.22
N$269: X3.20
N$270: X3.18
N$271: X3.16
N$272: X3.14
N$273: X3.12
N$274: X3.10
N$275: X3.8
N$276: X3.6
N$277: X3.4
N$278: X3.2
N$279: X4.3
N$280: X4.5
N$281: X4.7
N$282: X4.9
N$283: X4.11
N$284: X4.13
N$285: X4.15
N$286: X4.17
N$287: X4.19
N$288: X4.21
N$289: X4.23
N$290: X4.25
N$291: X4.27
N$292: X4.29
N$293: X4.31
N$294: X4.33
N$295: X4.35
N$296: X4.37
N$297: X4.39
N$298: X4.40
N$299: X4.38
N$300: X4.36
N$301: X4.34
N$302: X4.32
N$303: X4.30
N$304: X4.28
N$305: X4.26
N$306: X4.24
N$307: X4.22
N$308: X4.20
N$309: X4.18
N$310: X4.16
N$311: X4.14
N$312: X4.12
N$313: X4.10
N$314: X4.8
N$315: X4.6
N$316: X4.4
N$317: X4.2
OUTPUT1: IC1.2(A:I0) OK1.3(EMIT) OK2.3(EMIT) R5.2
OUTPUT2: IC1.3(A:I1) OK3.3(EMIT) OK4.3(EMIT) R6.2
OUTPUT3: IC1.4(A:I2) OK5.3(EMIT) OK6.3(EMIT) R7.2
OUTPUT4: IC1.5(A:I3) OK7.3(EMIT) OK8.3(EMIT) R8.2
OUTPUT5: IC1.9(B:I0) OK9.3(EMIT) OK10.3(EMIT) R13.2
OUTPUT6: IC1.10(B:I1) OK11.3(EMIT) OK12.3(EMIT) R14.2
OUTPUT7: IC1.11(B:I2) OK13.3(EMIT) OK14.3(EMIT) R15.2
OUTPUT8: IC1.12(B:I3) OK15.3(EMIT) OK16.3(EMIT) R16.2
OUTPUT9: IC2.2(A:I0) OK17.3(EMIT) OK18.3(EMIT) R21.2
OUTPUT10: IC2.3(A:I1) OK19.3(EMIT) OK20.3(EMIT) R22.2
OUTPUT11: IC2.4(A:I2) OK21.3(EMIT) OK22.3(EMIT) R23.2
OUTPUT12: IC2.5(A:I3) OK23.3(EMIT) OK24.3(EMIT) R24.2
OUTPUT13: IC2.9(B:I0) OK25.3(EMIT) OK26.3(EMIT) R29.2
OUTPUT14: IC2.10(B:I1) OK27.3(EMIT) OK28.3(EMIT) R30.2
OUTPUT15: IC2.11(B:I2) OK29.3(EMIT) OK30.3(EMIT) R31.2
OUTPUT16: IC2.12(B:I3) OK31.3(EMIT) OK32.3(EMIT) R32.2
OUTPUT17: IC3.2(A:I0) OK33.3(EMIT) OK34.3(EMIT) R37.2
OUTPUT18: IC3.3(A:I1) OK35.3(EMIT) OK36.3(EMIT) R38.2
OUTPUT19: IC3.4(A:I2) OK37.3(EMIT) OK38.3(EMIT) R39.2
OUTPUT20: IC3.5(A:I3) OK39.3(EMIT) OK40.3(EMIT) R40.2
OUTPUT21: IC3.9(B:I0) OK41.3(EMIT) OK42.3(EMIT) R45.2
OUTPUT22: IC3.10(B:I1) OK43.3(EMIT) OK44.3(EMIT) R46.2
OUTPUT23: IC3.11(B:I2) OK45.3(EMIT) OK46.3(EMIT) R47.2
OUTPUT24: IC3.12(B:I3) OK47.3(EMIT) OK48.3(EMIT) R48.2
OUTPUT25: IC4.2(A:I0) OK49.3(EMIT) OK50.3(EMIT) R53.2
OUTPUT26: IC4.3(A:I1) OK51.3(EMIT) OK52.3(EMIT) R54.2
OUTPUT27: IC4.4(A:I2) OK53.3(EMIT) OK54.3(EMIT) R55.2
OUTPUT28: IC4.5(A:I3) OK55.3(EMIT) OK56.3(EMIT) R56.2
OUTPUT29: IC4.9(B:I0) OK57.3(EMIT) OK58.3(EMIT) R61.2
OUTPUT30: IC4.10(B:I1) OK59.3(EMIT) OK60.3(EMIT) R62.2
OUTPUT31: IC4.11(B:I2) OK61.3(EMIT) OK62.3(EMIT) R63.2
OUTPUT32: IC4.12(B:I3) OK63.3(EMIT) OK64.3(EMIT) R64.2
OUTPUT33: IC5.2(A:I0) OK65.3(EMIT) OK66.3(EMIT) R69.2
OUTPUT34: IC5.3(A:I1) OK67.3(EMIT) OK68.3(EMIT) R70.2
OUTPUT35: IC5.4(A:I2) OK69.3(EMIT) OK70.3(EMIT) R71.2
OUTPUT36: IC5.5(A:I3) OK71.3(EMIT) OK72.3(EMIT) R72.2
OUTPUT37: IC5.9(B:I0) OK73.3(EMIT) OK74.3(EMIT) R77.2
OUTPUT38: IC5.10(B:I1) OK75.3(EMIT) OK76.3(EMIT) R78.2
OUTPUT39: IC5.11(B:I2) OK77.3(EMIT) OK78.3(EMIT) R79.2
OUTPUT40: IC5.12(B:I3) OK79.3(EMIT) OK80.3(EMIT) R80.2
OUTPUT41: IC6.2(A:I0) OK81.3(EMIT) OK82.3(EMIT) R85.2
OUTPUT42: IC6.3(A:I1) OK83.3(EMIT) OK84.3(EMIT) R86.2
OUTPUT43: IC6.4(A:I2) OK85.3(EMIT) OK86.3(EMIT) R87.2
OUTPUT44: IC6.5(A:I3) OK87.3(EMIT) OK88.3(EMIT) R88.2
OUTPUT45: IC6.9(B:I0) OK89.3(EMIT) OK90.3(EMIT) R93.2
OUTPUT46: IC6.10(B:I1) OK91.3(EMIT) OK92.3(EMIT) R94.2
OUTPUT47: IC6.11(B:I2) OK93.3(EMIT) OK94.3(EMIT) R95.2
OUTPUT48: IC6.12(B:I3) OK95.3(EMIT) OK96.3(EMIT) R96.2
OUTPUT49: IC7.2(A:I0) OK97.3(EMIT) OK98.3(EMIT) R101.2
OUTPUT50: IC7.3(A:I1) OK99.3(EMIT) OK100.3(EMIT) R102.2
OUTPUT51: IC7.4(A:I2) OK101.3(EMIT) OK102.3(EMIT) R103.2
OUTPUT52: IC7.5(A:I3) OK103.3(EMIT) OK104.3(EMIT) R104.2
OUTPUT53: IC7.9(B:I0) OK105.3(EMIT) OK106.3(EMIT) R109.2
OUTPUT54: IC7.10(B:I1) OK107.3(EMIT) OK108.3(EMIT) R110.2
OUTPUT55: IC7.11(B:I2) OK109.3(EMIT) OK110.3(EMIT) R111.2
OUTPUT56: IC7.12(B:I3) OK111.3(EMIT) OK112.3(EMIT) R112.2
OUTPUT57: IC8.2(A:I0) OK113.3(EMIT) OK114.3(EMIT) R117.2
OUTPUT58: IC8.3(A:I1) OK115.3(EMIT) OK116.3(EMIT) R118.2
OUTPUT59: IC8.4(A:I2) OK117.3(EMIT) OK118.3(EMIT) R119.2
OUTPUT60: IC8.5(A:I3) OK119.3(EMIT) OK120.3(EMIT) R120.2
OUTPUT61: IC8.9(B:I0) OK121.3(EMIT) OK122.3(EMIT) R125.2
OUTPUT62: IC8.10(B:I1) OK123.3(EMIT) OK124.3(EMIT) R126.2
OUTPUT63: IC8.11(B:I2) OK125.3(EMIT) OK126.3(EMIT) R127.2
OUTPUT64: IC8.12(B:I3) OK127.3(EMIT) OK128.3(EMIT) R128.2
OUTPUT65: IC9.2(A:I0) OK129.3(EMIT) OK130.3(EMIT) R133.2
OUTPUT66: IC9.3(A:I1) OK131.3(EMIT) OK132.3(EMIT) R134.2
OUTPUT67: IC9.4(A:I2) OK133.3(EMIT) OK134.3(EMIT) R135.2
OUTPUT68: IC9.5(A:I3) OK135.3(EMIT) OK136.3(EMIT) R136.2
OUTPUT69: IC9.9(B:I0) OK137.3(EMIT) OK138.3(EMIT) R141.2
OUTPUT70: IC9.10(B:I1) OK139.3(EMIT) OK140.3(EMIT) R142.2
OUTPUT71: IC9.11(B:I2) OK141.3(EMIT) OK142.3(EMIT) R143.2
OUTPUT72: IC9.12(B:I3) OK143.3(EMIT) OK144.3(EMIT) R144.2
OUTPUT73: IC10.2(A:I0) OK145.3(EMIT) OK146.3(EMIT) R149.2
OUTPUT74: IC10.3(A:I1) OK147.3(EMIT) OK148.3(EMIT) R150.2
OUTPUT75: IC10.4(A:I2) OK149.3(EMIT) OK150.3(EMIT) R151.2
OUTPUT76: IC10.5(A:I3) OK151.3(EMIT) OK152.3(EMIT) R152.2
OUTPUT77: IC10.9(B:I0) OK153.3(EMIT) OK154.3(EMIT) R157.2
OUTPUT78: IC10.10(B:I1) OK155.3(EMIT) OK156.3(EMIT) R158.2
OUTPUT79: IC10.11(B:I2) OK157.3(EMIT) OK158.3(EMIT) R159.2
OUTPUT80: IC10.12(B:I3) OK159.3(EMIT) OK160.3(EMIT) R160.2
TAB1: OK1.1(A) OK2.2(C) OK3.1(A) OK4.2(C) OK5.1(A) OK6.2(C) OK7.1(A) OK8.2(C)
TAB2: OK9.1(A) OK10.2(C) OK11.1(A) OK12.2(C) OK13.1(A) OK14.2(C) OK15.1(A) OK16.2(C) OK17.1(A) OK18.2(C) OK19.1(A) OK20.2(C) OK21.1(A) OK22.2(C) OK23.1(A) OK24.2(C)
TAB3: OK25.1(A) OK26.2(C) OK27.1(A) OK28.2(C) OK29.1(A) OK30.2(C) OK31.1(A) OK32.2(C) OK33.1(A) OK34.2(C) OK35.1(A) OK36.2(C) OK37.1(A) OK38.2(C) OK39.1(A) OK40.2(C)
TAB4: OK41.1(A) OK42.2(C) OK43.1(A) OK44.2(C) OK45.1(A) OK46.2(C) OK47.1(A) OK48.2(C) OK49.1(A) OK50.2(C) OK51.1(A) OK52.2(C) OK53.1(A) OK54.2(C) OK55.1(A) OK56.2(C)
TAB5: OK57.1(A) OK58.2(C) OK59.1(A) OK60.2(C) OK61.1(A) OK62.2(C) OK63.1(A) OK64.2(C) OK65.1(A) OK66.2(C) OK67.1(A) OK68.2(C) OK69.1(A) OK70.2(C) OK71.1(A) OK72.2(C)
TAB6: OK73.1(A) OK74.2(C) OK75.1(A) OK76.2(C) OK77.1(A) OK78.2(C) OK79.1(A) OK80.2(C) OK81.1(A) OK82.2(C) OK83.1(A) OK84.2(C) OK85.1(A) OK86.2(C) OK87.1(A) OK88.2(C)
TAB7: OK89.1(A) OK90.2(C) OK91.1(A) OK92.2(C) OK93.1(A) OK94.2(C) OK95.1(A) OK96.2(C) OK97.1(A) OK98.2(C) OK99.1(A) OK100.2(C) OK101.1(A) OK102.2(C) OK103.1(A) OK104.2(C)
TAB8: OK105.1(A) OK106.2(C) OK107.1(A) OK108.2(C) OK109.1(A) OK110.2(C) OK111.1(A) OK112.2(C) OK113.1(A) OK114.2(C) OK115.1(A) OK116.2(C) OK117.1(A) OK118.2(C) OK119.1(A) OK120.2(C)
TAB9: OK121.1(A) OK122.2(C) OK123.1(A) OK124.2(C) OK125.1(A) OK126.2(C) OK127.1(A) OK128.2(C) OK129.1(A) OK130.2(C) OK131.1(A) OK132.2(C) OK133.1(A) OK134.2(C) OK135.1(A) OK136.2(C)
TAB10: OK137.1(A) OK138.2(C) OK139.1(A) OK140.2(C) OK141.1(A) OK142.2(C) OK143.1(A) OK144.2(C) OK145.1(A) OK146.2(C) OK147.1(A) OK148.2(C) OK149.1(A) OK150.2(C) OK151.1(A) OK152.2(C)
TAB11: OK153.1(A) OK154.2(C) OK155.1(A) OK156.2(C) OK157.1(A) OK158.2(C) OK159.1(A) OK160.2(C)

## Power pins joined to a net without a drawn wire
VDD: IC1.14(P:VDD) IC2.14(P:VDD) IC3.14(P:VDD) IC4.14(P:VDD) IC5.14(P:VDD) IC6.14(P:VDD) IC7.14(P:VDD) IC8.14(P:VDD) IC9.14(P:VDD) IC10.14(P:VDD) IC11.14(P:VDD) IC12.14(P:VDD) IC13.14(P:VDD) IC14.14(P:VDD)
VSS: IC1.7(P:VSS) IC2.7(P:VSS) IC3.7(P:VSS) IC4.7(P:VSS) IC5.7(P:VSS) IC6.7(P:VSS) IC7.7(P:VSS) IC8.7(P:VSS) IC9.7(P:VSS) IC10.7(P:VSS) IC11.7(P:VSS) IC12.7(P:VSS) IC13.7(P:VSS) IC14.7(P:VSS)

## Library data of the parts
IC1-IC14 = 40xx:4072: Dual 4-input OR
OK1-OK160 = iowaFormula:PC817-S: SHARP OPTO COUPLER
R1-R160 = rcl:R-US_: RESISTOR, American symbol; SPICEPREFIX: R
X1-X4 = con-molex:52760-0479: MOLEX Connector SD-52760-**79 Source: 52760-1079_sd molex.pdf; MF: MOLEX; OC_FARNELL: unknown; OC_NEWARK: unknown